# EAGLE design ZasilanieLED (EAGLE 7.6.0)
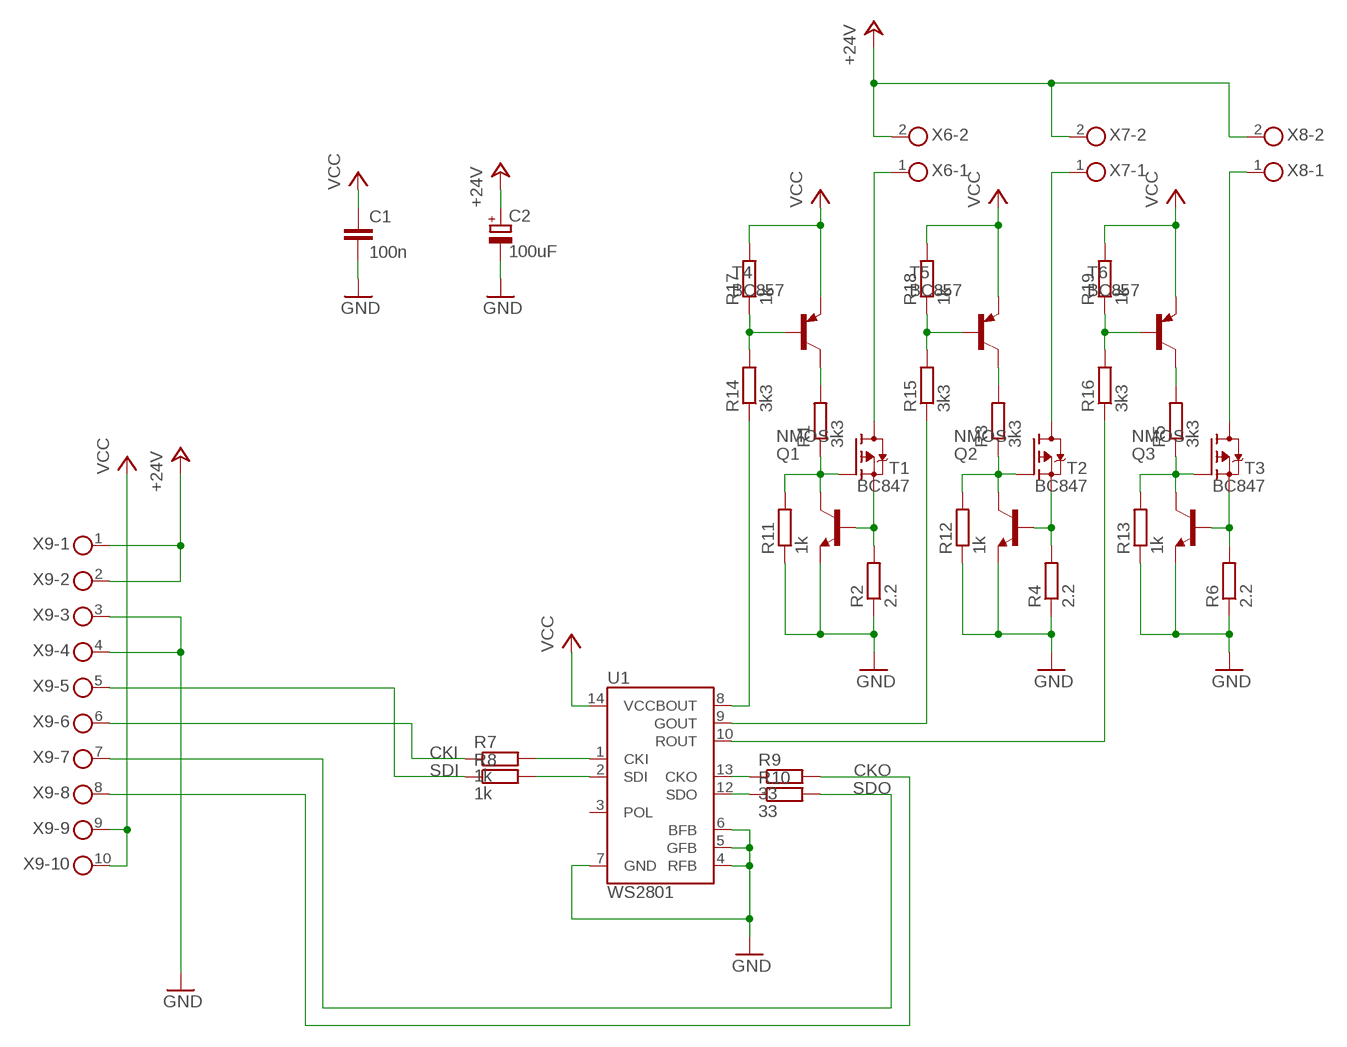
[diagram p0: schematic, sheet 1]

## Parts
C1  100n  C-EUC1206  [C1206]
C2  100uF  CPOL-EUE5-10.5  [E5-10,5]
Q1  NMOS  SPD30P06PTO252  [TO252]
Q2  NMOS  SPD30P06PTO252  [TO252]
Q3  NMOS  SPD30P06PTO252  [TO252]
R1  3k3  R-EU_R1206  [R1206]
R2  2.2  R-EU_0207/10  [0207/10]
R3  3k3  R-EU_R1206  [R1206]
R4  2.2  R-EU_0207/10  [0207/10]
R5  3k3  R-EU_R1206  [R1206]
R6  2.2  R-EU_0207/10  [0207/10]
R7  1k  R-EU_R1206  [R1206]
R8  1k  R-EU_R1206  [R1206]
R9  33  R-EU_R1206  [R1206]
R10  33  R-EU_R1206  [R1206]
R11  1k  R-EU_R1206  [R1206]
R12  1k  R-EU_R1206  [R1206]
R13  1k  R-EU_R1206  [R1206]
R14  3k3  R-EU_R1206  [R1206]
R15  3k3  R-EU_R1206  [R1206]
R16  3k3  R-EU_R1206  [R1206]
R17  1k  R-EU_R1206  [R1206]
R18  1k  R-EU_R1206  [R1206]
R19  1k  R-EU_R1206  [R1206]
T1  BC847  [SOT23]
T2  BC847  [SOT23]
T3  BC847  [SOT23]
T4  BC857  BC857A-PNP-SOT23-BEC  [SOT23-BEC]
T5  BC857  BC857A-PNP-SOT23-BEC  [SOT23-BEC]
T6  BC857  BC857A-PNP-SOT23-BEC  [SOT23-BEC]
U1  WS2801  [SOP-14]
X6  AKL59-02  [2POL35]
X7  AKL59-02  [2POL35]
X8  AKL59-02  [2POL35]
X9  AKL59-10  [10POL35]

## Nets
+24V: C2.+ X6.2 X7.2 X8.2 X9.1 X9.2
CKI: R7.1 X9.6
CKO: R9.2 X9.8
GND: C1.2 C2.- R2.1 R4.1 R6.1 R11.1 R12.1 R13.1 T1.2(E) T2.2(E) T3.2(E) U1.4(RFB) U1.5(GFB) U1.6(BFB) U1.7(GND) X9.3 X9.4
N$1: R7.2 U1.1(CKI)
N$2: R8.2 U1.2(SDI)
N$3: R9.1 U1.13(CKO)
N$4: R14.1 U1.8(BOUT)
N$5: R15.1 U1.9(GOUT)
N$6: R16.1 U1.10(ROUT)
N$7: Q1.2(S) R2.2 T1.1(B)
N$8: Q2.2(S) R4.2 T2.1(B)
N$9: Q3.2(S) R6.2 T3.1(B)
N$10: R10.1 U1.12(SDO)
N$11: Q1.3(D) X6.1
N$12: Q2.3(D) X7.1
N$13: Q3.3(D) X8.1
N$14: R1.2 T4.C
N$15: R3.2 T5.C
N$16: R5.2 T6.C
N$17: Q1.1(G) R1.1 R11.2 T1.3(C)
N$18: Q2.1(G) R3.1 R12.2 T2.3(C)
N$19: Q3.1(G) R5.1 R13.2 T3.3(C)
N$20: R14.2 R17.1 T4.B
N$21: R15.2 R18.1 T5.B
N$22: R16.2 R19.1 T6.B
SDI: R8.1 X9.5
SDO: R10.2 X9.7
VCC: C1.1 R17.2 R18.2 R19.2 T4.E T5.E T6.E U1.14(VCC) X9.9 X9.10
Unconnected: U1.3(POL)

## Library data of the parts
C1 = rcl:C-EU: CAPACITOR, European symbol
C2 = rcl:CPOL-EU: POLARIZED CAPACITOR, European symbol
Q1-Q3 = transistor-fet:SPD30P06P: SIPMOS(R) Power-Transistor P-Channel, Enhancement mode Source: http://www.infineon.com/upload/Document/cmc_upload/documents/012/3615/SPD_U30P06P.pdf
R1-R19 = rcl:R-EU_: RESISTOR, European symbol
T1-T3 = transistor:BC847: NPN TRANSISTOR
T4-T6 = transistor:*-PNP-: PNP Transistror
U1 = SparkFun:WS2801: WS2801 3 Channel Constant Current LED Driver with programmable PWM outputs. Datasheet: http://www.sparkfun.com/datasheets/Components/LED/WS2801.pdf
X6-X8 = con-ria-59:AKL59-02: RIA Anschlussklemme Typ 59, Raster 3,5 mm, Polzahl 2
X9 = con-ria-59:AKL59-10: RIA Anschlussklemme Typ 59, Raster 3,5 mm, Polzahl 10

## Board
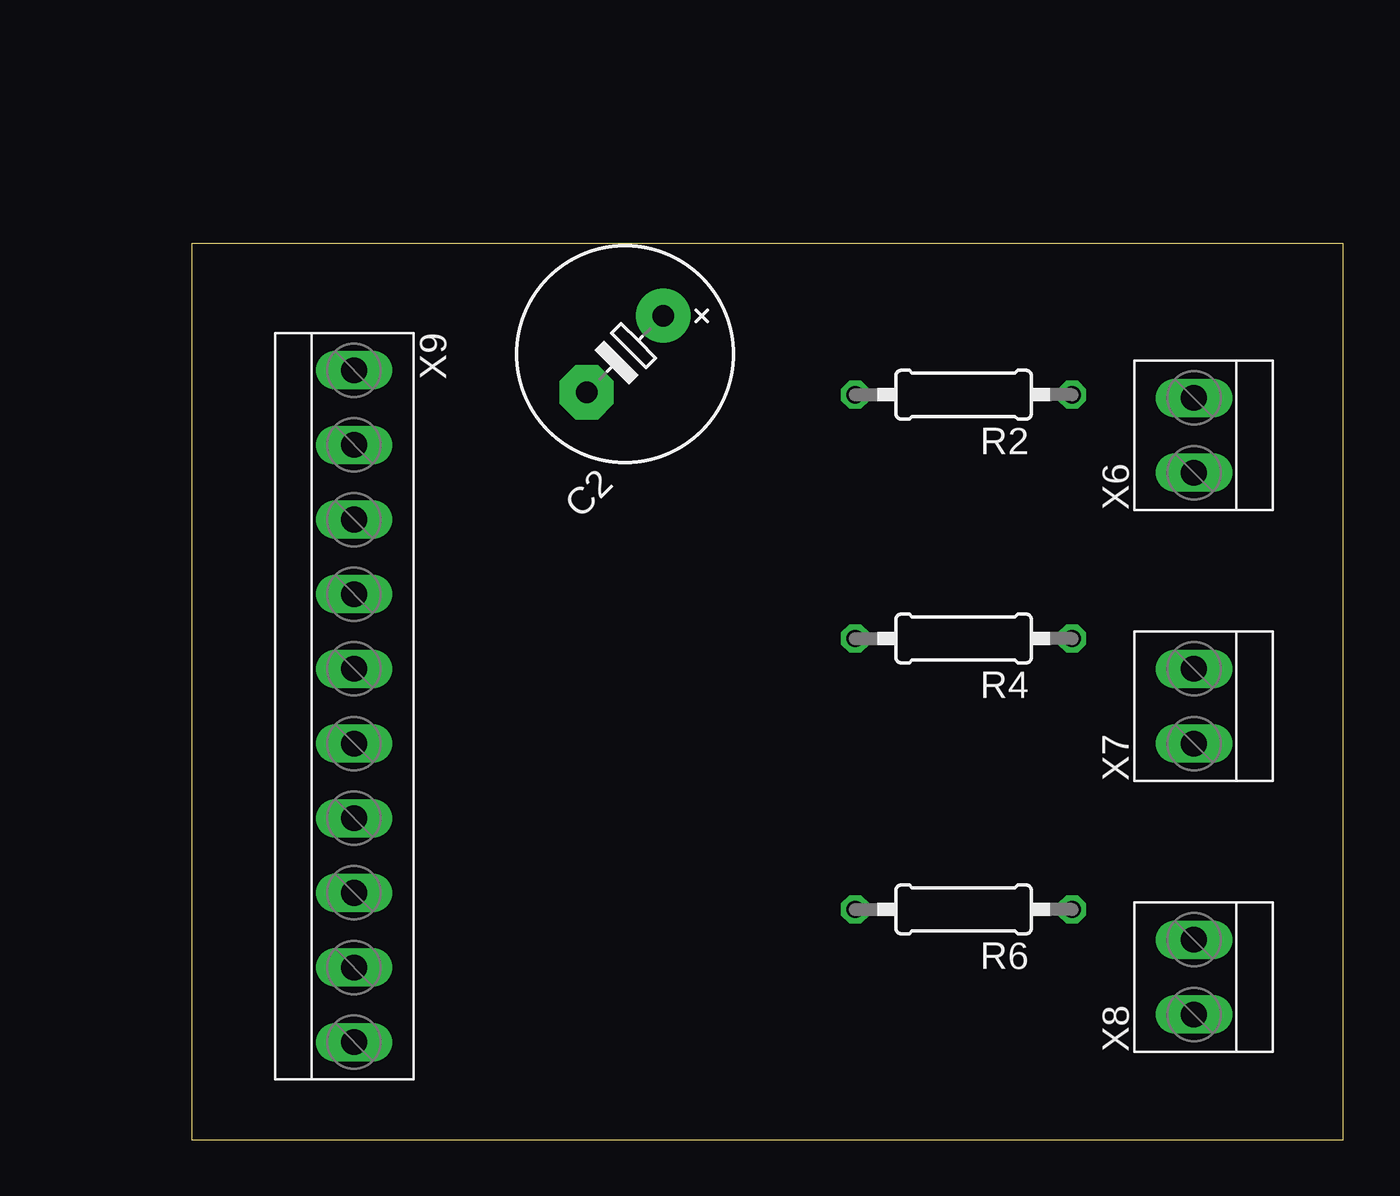
[diagram p1: board, top side]
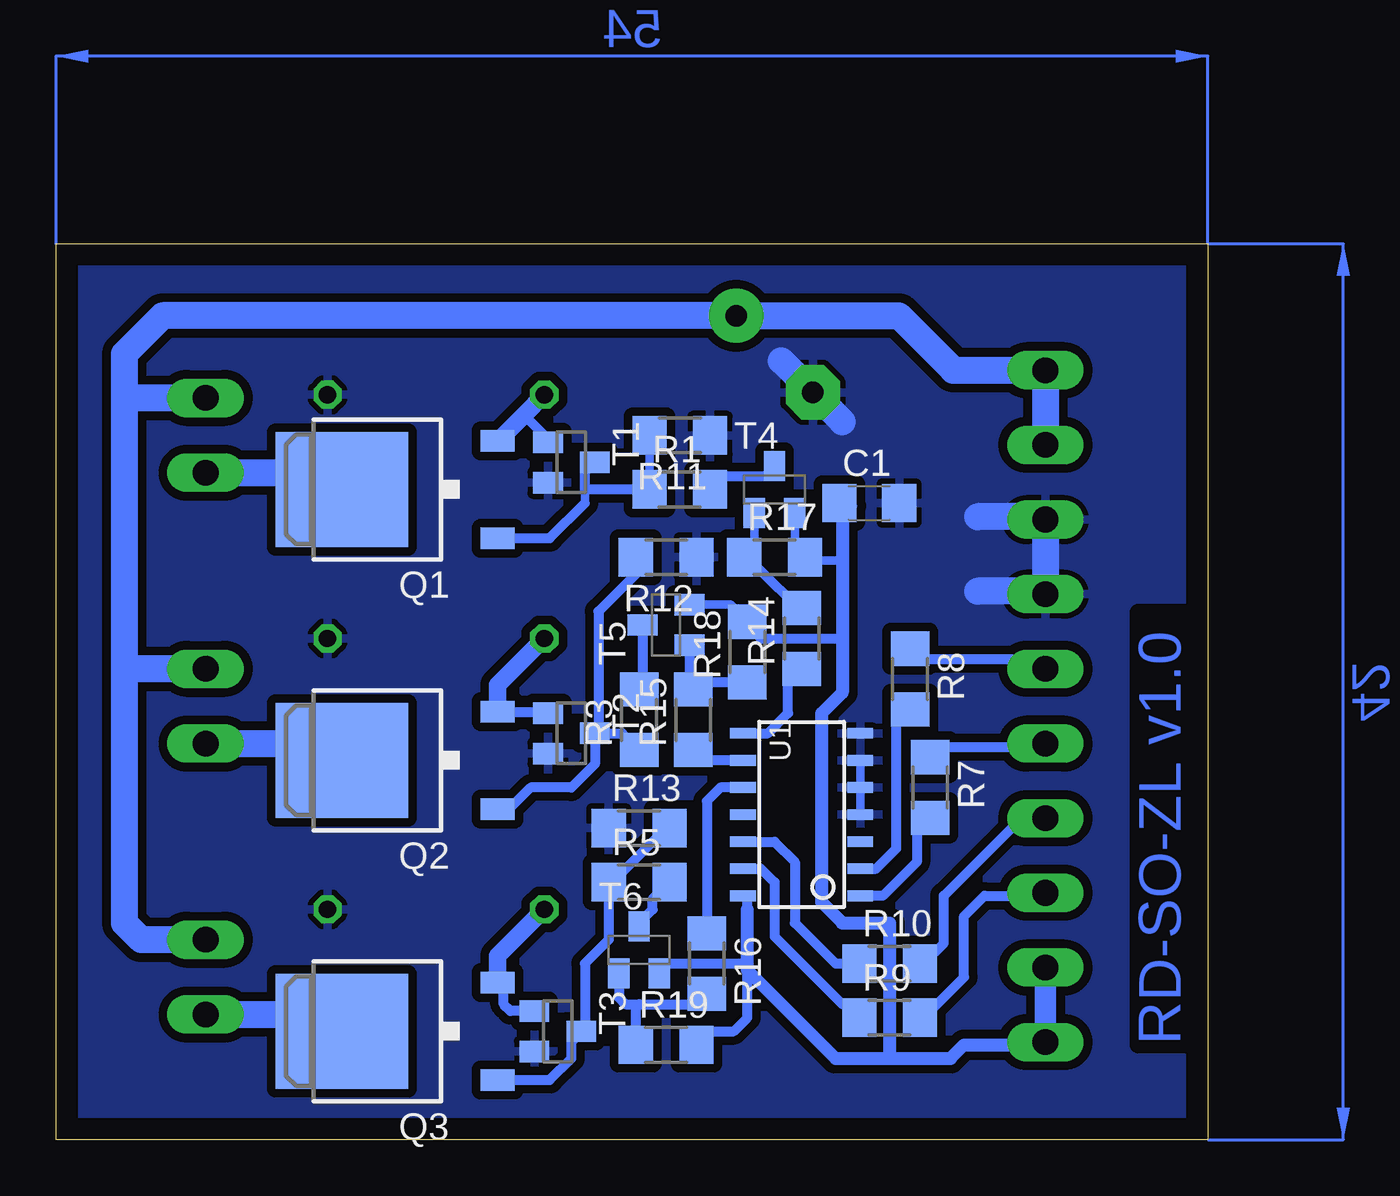
[diagram p2: board, bottom side, seen from below]

Size 54 x 42 mm. Coordinates in mm from the lower left corner, seen from the top.
Outline: 0,0 54,0 54,42 0,42 0,0
Copper layers (1*16): Top 0.035mm / dielectric 1.5mm / Bottom 0.035mm
Design rules "default *": minimum track width 10mil, minimum drill 24mil, track to track 8mil, track to pad 8mil, pad to pad 8mil, via to via 8mil, smd to smd 8mil, copper to edge 40mil, drill to drill 8mil, minimum pad ring 10mil, minimum via ring 8mil, stop-mask expansion 4mil, vias tented up to drill 0mil, thermal gap 10mil

### Footprints (pad centres in the part's own frame; a part is rotated, then mirrored left to right if it is on the bottom)
C1206 = smd 1.6 x 1.8: 1 -1.4,0; 2 1.4,0
E5-10,5 = drill 1.016 pad 2.54: + -2.54,0 | drill 1.016 pad 2.54 octagon: - 2.54,0
TO252 = smd 1 x 1.6: 1 -2.28,-4.8; 2 2.28,-4.8 | smd 5.4 x 6.2: 3 0,2.5
R1206 = smd 1.6 x 1.803: 1 -1.422,0; 2 1.422,0
0207/10 = drill 0.813 octagon: 1 -5.08,0; 2 5.08,0
SOT23 = smd 1 x 1.4: 1 -0.95,-1.1; 2 0.95,-1.1; 3 0,1.1
SOT23-BEC = smd 1 x 1.4: B -0.95,-1.1; C 0,1.1; E 0.95,-1.1
SOP-14 = smd 0.5 x 1.2: 1 -3.81,-2.75; 2 -2.54,-2.75; 3 -1.27,-2.75; 4 0,-2.75; 5 1.27,-2.75; 6 2.54,-2.75; 7 3.81,-2.75; 8 3.81,2.75; 9 2.54,2.75; 10 1.27,2.75; 11 0,2.75; 12 -1.27,2.75; 13 -2.54,2.75; 14 -3.81,2.75
2POL35 = drill 1.2 long: 1 -1.75,0; 2 1.75,0
10POL35 = drill 1.2 long: 1 -15.75,0; 2 -12.25,0; 3 -8.75,0; 4 -5.25,0; 5 -1.75,0; 6 1.75,0; 7 5.25,0; 8 8.75,0; 9 12.25,0; 10 15.75,0

### Placement (x,y rotation side)
C1  15.88,29.84 0 bottom
C2  20.32,36.83 225 top
Q1  38.1,30.48 90 bottom
Q2  38.1,17.78 90 bottom
Q3  38.1,5.08 90 bottom
R1  24.77,30.48 0 bottom
R2  36.2,34.92 180 top
R3  26.67,19.68 90 bottom
R4  36.2,23.5 180 top
R5  26.67,12.06 0 bottom
R6  36.2,10.79 180 top
R7  13.02,16.51 270 bottom
R8  13.97,21.59 270 bottom
R9  14.92,5.71 0 bottom
R10  14.92,8.26 0 bottom
R11  24.77,33.02 180 bottom
R12  25.4,27.3 180 bottom
R13  26.67,14.61 0 bottom
R14  19.05,23.5 90 bottom
R15  24.13,19.68 90 bottom
R16  23.5,8.26 270 bottom
R17  20.32,27.3 0 bottom
R18  21.59,22.86 90 bottom
R19  25.4,4.45 0 bottom
T1  29.84,31.75 270 bottom
T2  29.84,19.05 270 bottom
T3  30.48,5.08 270 bottom
T4  20.32,30.48 0 bottom
T5  25.4,24.13 90 bottom
T6  26.67,8.89 0 bottom
U1  19.05,15.24 90 bottom
X6  46.99,33.02 90 top
X7  46.99,20.32 90 top
X8  46.99,7.62 90 top
X9  7.62,20.32 270 top

### Tracks (layer width: path | path; a pad name or v marks a point on that pad's centre or on a via)
+24V
  Bottom 1.27: X9.2 X9.1 11.94,36.07 14.5,38.63 C2.+ 49,38.63 50.8,36.83 50.8,34.92 | 50.8,34.92 50.8,22.23 | 50.8,22.23 50.8,10.16 50.01,9.37 X8.2 | X7.2 50.65,22.07 50.8,22.23 | X6.2 50.65,34.77 50.8,34.92
CKI
  Bottom 0.457: R7.1 13.02,18.41 7.78,18.41 X9.6
CKO
  Bottom 0.457: X9.8 7.76,11.43 10.48,11.43 11.43,10.48 11.43,7.62 13.34,5.71 R9.2
GND
  Bottom 0.406: U1.4 U1.5 U1.6
  Bottom 1.27: 17.14,33.66 20,36.51 | 10.79,29.21 7.62,29.21 7.62,25.72 | 7.62,25.4 7.62,25.72 | 7.62,25.72 10.79,25.72
  pour Bottom (isolate 0.406): -1.27,43.18 54.61,43.18 54.61,-1.27 -1.27,-1.27
N$1
  Bottom 0.457: R7.2 13.17,15.09 13.65,14.61 13.65,13.02 15.24,11.43 U1.1
N$2
  Bottom 0.457: U1.2 15.56,12.7 14.61,13.65 14.61,20.17 R8.2
N$3
  Bottom 0.406: 16.66,6.35 R9.1
  Bottom 0.457: U1.13 20.95,12.7 20.32,12.06 20.32,9.53 17.14,6.35 16.66,6.35
N$4
  Bottom 0.457: U1.8 20.64,19.05 19.68,20 19.68,21.44 R14.1
N$5
  Bottom 0.457: U1.9 23.96,17.78 R15.1
N$6
  Bottom 0.457: U1.10 22.86,16.51 23.5,15.88 R16.1
N$7
  Bottom 0.457: T1.1 30.95,32.85 32.07,33.97
  Bottom 0.813: Q1.2 33.28,32.76 32.07,33.97 R2.2
N$8
  Bottom 0.457: Q2.2 31,20.06 T2.1
  Bottom 0.813: Q2.2 33.3,21.31 R4.2
N$9
  Bottom 0.457: T3.1 32.7,6.03 33.02,6.35 33.02,7.08 Q3.2
  Bottom 0.813: Q3.2 33.3,8.61 R6.2
N$10
  Bottom 0.457: U1.12 20.32,13.97 19.37,13.02 19.37,10.16 17.46,8.26 R10.1
N$11
  Bottom 1.27: X6.1 41.39,31.27 Q1.3
N$12
  Bottom 1.27: X7.1 41.39,18.57 Q2.3
N$13
  Bottom 1.27: X8.1 41.39,5.87 Q3.3
N$14
  Bottom 0.406: R1.2 23.34,30.63 22.86,31.11 | 20.79,31.11 T4.C
  Bottom 0.457: 22.86,31.11 20.79,31.11
N$15
  Bottom 0.457: T5.C 26.5,21.28 R3.2
N$16
  Bottom 0.457: T6.C 26.67,10.16 26.04,10.79 26.04,11.28 R5.2
N$17
  Bottom 0.406: 29.21,30.48 29.21,29.84 | 29.21,31.29 T1.3 | R11.2 R1.1
  Bottom 0.457: Q1.1 30.86,28.2 29.21,29.84 | R1.1 29.21,30.48 29.21,31.29
N$18
  Bottom 0.406: 28.57,19.22 T2.3 | Q2.1 32.76,15.5
  Bottom 0.457: R12.2 26.82,26.52 28.57,24.77 28.57,19.22 | R3.1 27.46,19.05 T2.3 28.75,17.61 29.84,16.51 31.75,16.51 32.76,15.5
N$19
  Bottom 0.406: R13.2 25.55,14.61 25.55,14.45 | 29.21,5.25 T3.3 | R5.1 27.94,12.06
  Bottom 0.457: R5.1 28.09,9.37 29.21,8.26 29.21,5.25 | 27.94,12.06 25.55,14.45 | Q3.1 30.86,2.8 29.84,3.81 29.84,4.62 T3.3
N$20
  Bottom 0.406: T4.B 21.27,27.78 R17.1 21.59,26.84 | R14.2 19.2,24.92
  Bottom 0.457: 19.2,24.92 20.95,26.67 21.59,26.84
N$21
  Bottom 0.406: 24.3,21.28 24.3,21.59 24.15,21.44
  Bottom 0.457: T5.B 24.3,21.59 | 24.3,21.28 R15.2 | R18.1 24.15,21.44
N$22
  Bottom 0.406: 26.82,6.2 26.67,6.35
  Bottom 0.457: T6.B 27.62,6.67 27.3,6.35 26.67,6.35 23.98,6.35 R16.2 | R19.1 26.82,6.2
SDI
  Bottom 0.457: R8.1 13.8,23.01 13.34,22.54 8.09,22.54 X9.5
SDO
  Bottom 0.457: X9.7 7.77,14.92 8.89,14.92 12.38,11.43 12.38,9.21 13.34,8.26 R10.2
VCC
  Bottom 0.406: T5.E 22.39,25.08 R18.2 21.59,24.13 | C1.1 16.64,29.71 17.14,29.21 | T4.E 19.37,27.78 R17.2 18.9,27.15 17.3,27.15 17.14,27.3 | T6.E 25.72,7.93
  Bottom 0.457: 21.59,24.13 20.95,23.5 17.14,23.5 | 21.59,10.79 21.59,11.22 U1.14 | R19.2 23.98,4.6 23.5,5.08 22.23,5.08 21.59,5.71 21.59,7.94 | 25.72,7.93 25.4,8.26 21.59,8.26
  Bottom 0.61: 17.14,29.21 17.14,27.3 17.14,23.5 17.14,20.95 18.1,20 18.1,11.11 17.14,10.16 14.92,10.16 14.92,3.81 | 21.59,10.79 21.59,8.26 21.59,7.94 17.46,3.81 14.92,3.81 | 14.92,3.81 12.06,3.81 11.43,4.45 8.06,4.45 X9.10
  Bottom 1.016: X9.9 X9.10
(copper drawn outside any net)
  shapes: Bottom area x2

### Text on the board
Bottom: RD-SO-ZL v1.0